# Altium schematic sheet Block_diagram.SchDoc
size A4; DocumentNumber: 1; SheetNumber: 1; SheetTotal: 3
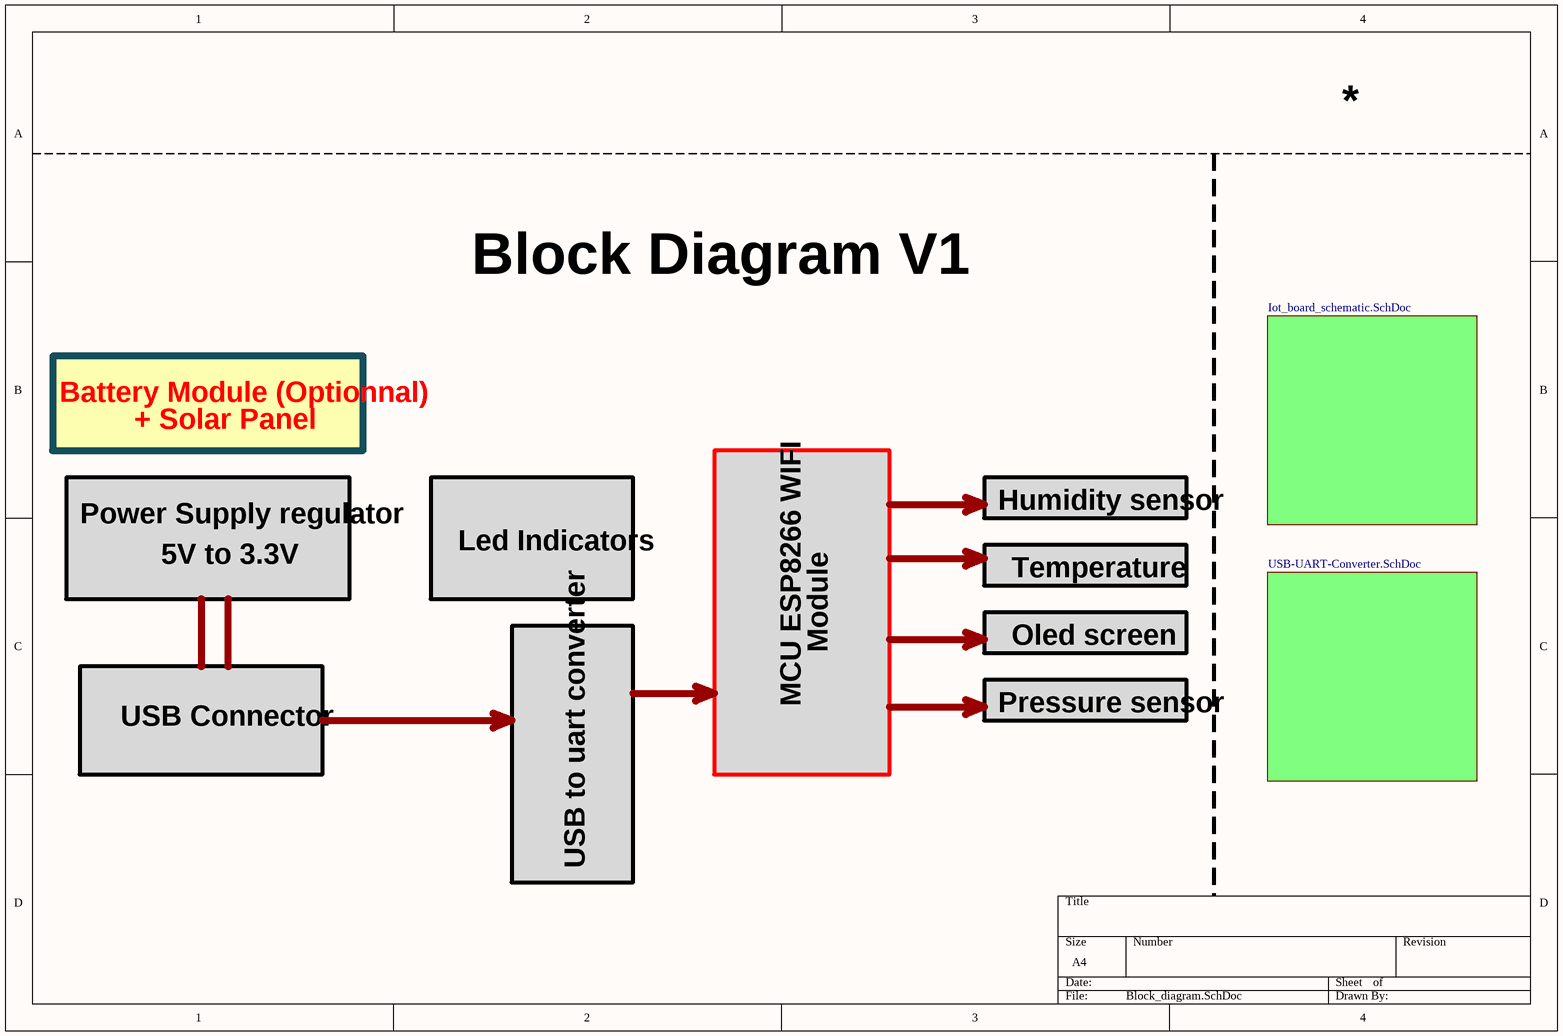
[diagram p0: Block_diagram.SchDoc]

## Sub-sheets
Designator = USB-UART-Converter.SchDoc: no entries
? = Iot_board_schematic.SchDoc: no entries

## Notes on the sheet
- Block Diagram V1
- Battery Module (Optionnal)
- + Solar Panel
- Humidity sensor
- Power Supply regulator
- 5V to 3.3V
- Led Indicators
- Temperature
- Module
- Oled screen
- MCU ESP8266 WIFI
- Pressure sensor
- USB Connector
- USB to uart converter